# Altium schematic sheet Gateway.SchDoc: Gateway
size A3; Author: Lucas Liaño; Revision: 1; SheetNumber: 2; SheetTotal: 8
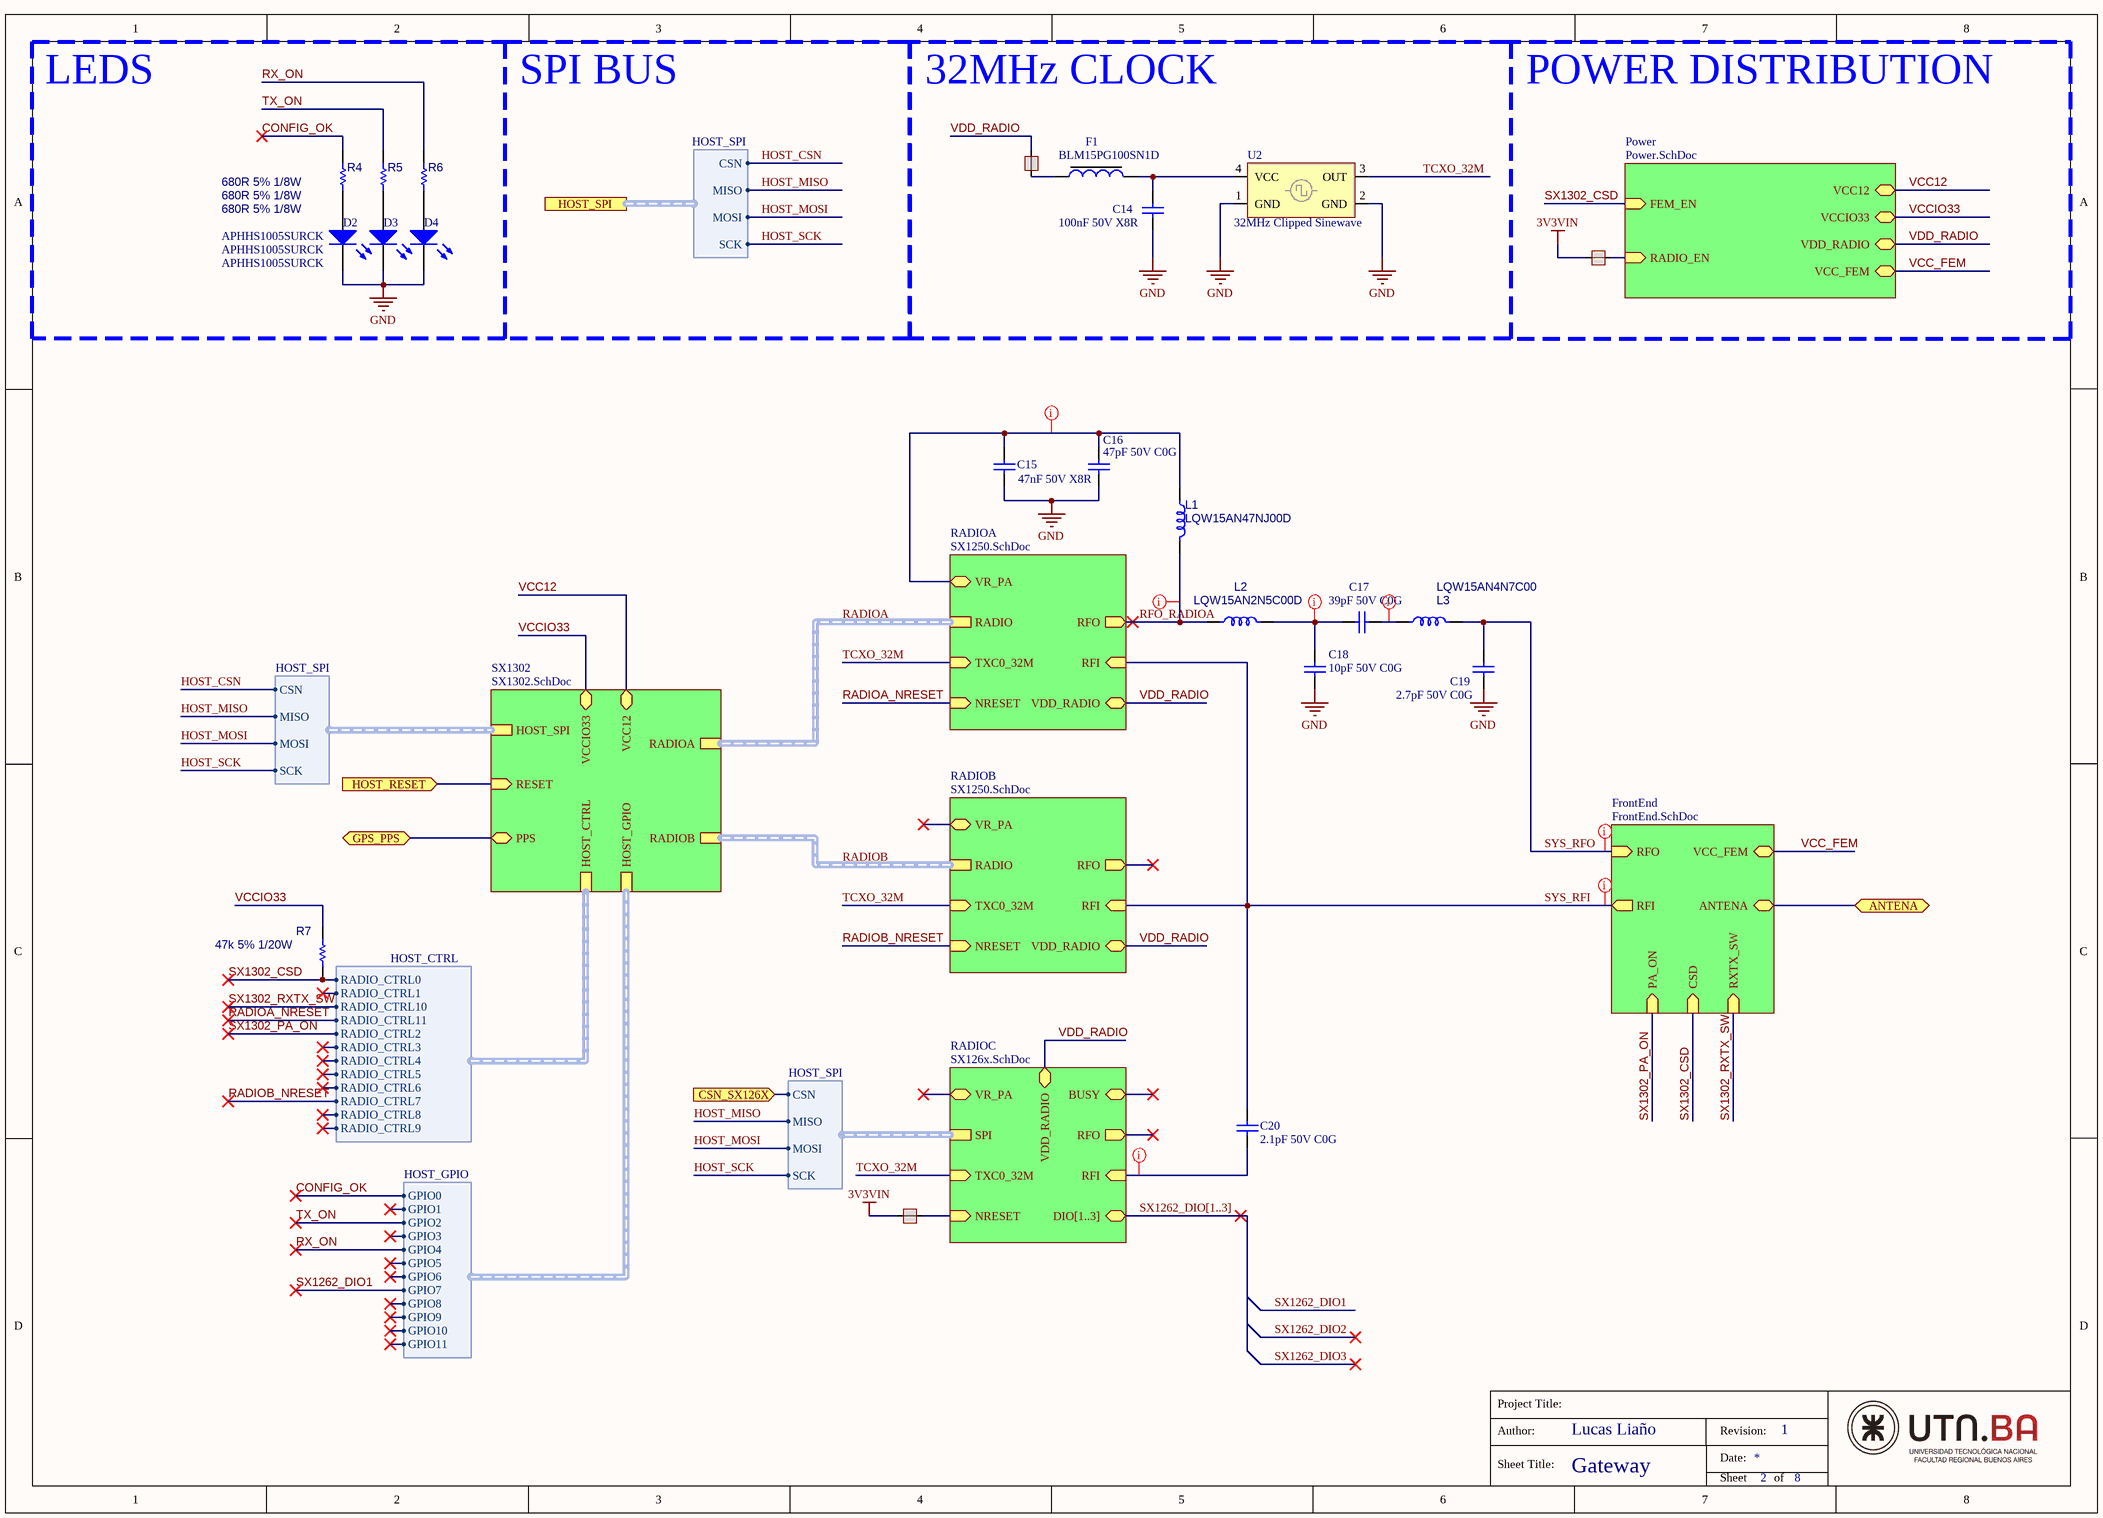
[diagram p0: Gateway.SchDoc]

## Parts
C14  100nF 50V X8R  [C_0603]
C15  47nF 50V X8R  [C_0603]
C16  47pF 50V C0G  [C_0603]
C17  39pF 50V C0G  [C_0603]
C18  10pF 50V C0G  [C_0603]
C19  2.7pF 50V C0G  [C_0603]
C20  2.1pF 50V C0G  [C_0603]
D2  APHHS1005SURCK  [D_0402]
D3  APHHS1005SURCK  [D_0402]
D4  APHHS1005SURCK  [D_0402]
F1  BLM15PG100SN1D  [L_0402]
L1  LQW15AN47NJ00D  [L_0402]
L2  LQW15AN2N5C00D  [L_0402]
L3  LQW15AN4N7C00  [L_0402]
NT1  NT  [NTIE12]  (value not drawn)  (net tie, no BOM)
NT13  NT  [NTIE12]  (value not drawn)  (net tie, no BOM)
NT15  NT  [NTIE12]  (value not drawn)  (net tie, no BOM)
R4  680R 5% 1/8W  [0603[1608]]
R5  680R 5% 1/8W  [0603[1608]]
R6  680R 5% 1/8W  [0603[1608]]
R7  47k 5% 1/20W  [0603[1608]]
U2  32MHz Clipped Sinewave  [TCXO 2.0x1.6mm]

## Blocks framed on the sheet
LEDS: D2-D4 R4-R6

## Sub-sheets
FrontEnd = FrontEnd.SchDoc: ANTENA (bidir), RFO (in), RFI (out), PA_ON (in), CSD (in), RXTX_SW (in), VCC_FEM (bidir)
Power = Power.SchDoc: FEM_EN (in), RADIO_EN (in), VCC12 (bidir), VCCIO33 (bidir), VDD_RADIO (bidir), VCC_FEM (bidir)
RADIOA = SX1250.SchDoc: RFI (in), VR_PA (bidir), RADIO (harness RADIO), NRESET (in), RFO (out), TXC0_32M (in), VDD_RADIO (bidir)
RADIOB = SX1250.SchDoc: VR_PA (bidir), RFO (out), RADIO (harness RADIO), NRESET (in), RFI (in), TXC0_32M (in), VDD_RADIO (bidir)
RADIOC = SX126x.SchDoc: RFI (in), DIO[1..3] (bidir), RFO (out), NRESET (in), SPI (harness HOST_SPI), VR_PA (bidir), TXC0_32M (in), BUSY (bidir), VDD_RADIO (bidir)
SX1302 = SX1302.SchDoc: RADIOB (harness RADIO), HOST_GPIO (harness HOST_GPIO), PPS (bidir), RESET (in), RADIOA (harness RADIO), HOST_CTRL (harness HOST_CTRL), HOST_SPI (harness HOST_SPI), VCCIO33 (bidir), VCC12 (bidir)

## Ports
ANTENA (bidir), CSN_SX126X (in), GPS_PPS (bidir), HOST_RESET (in), HOST_SPI (harness HOST_SPI)

## Harnesses
HOST_CTRL: RADIO_CTRL0, RADIO_CTRL1, RADIO_CTRL10, RADIO_CTRL11, RADIO_CTRL2, RADIO_CTRL3, RADIO_CTRL4, RADIO_CTRL5, RADIO_CTRL6, RADIO_CTRL7, RADIO_CTRL8, RADIO_CTRL9
HOST_GPIO: GPIO1, GPIO2, GPIO3, GPIO4, GPIO5, GPIO6, GPIO7, GPIO8, GPIO9, GPIO10, GPIO11, GPIO0
HOST_SPI: CSN, MISO, MOSI, SCK

## Nets
3V3VIN: NT1.1 NT15.1
GND: C14.2 C15.2 C16.2 C18.1 C19.2 D2.2(K) D3.2(K) D4.2(K) U2.1(GND) U2.2(GND)
ANTENA: port ANTENA, sheet FrontEnd/ANTENA
CONFIG_OK: R4.2 ; sheet SX1302/HOST_GPIO.GPIO0
CSN_SX126X: port CSN_SX126X, sheet RADIOC/SPI.CSN
GPS_PPS: port GPS_PPS, sheet SX1302/PPS
HOST_CSN: port HOST_SPI.CSN, sheet SX1302/HOST_SPI.CSN
HOST_MISO: port HOST_SPI.MISO, sheet SX1302/HOST_SPI.MISO, sheet RADIOC/SPI.MISO
HOST_MOSI: port HOST_SPI.MOSI, sheet SX1302/HOST_SPI.MOSI, sheet RADIOC/SPI.MOSI
HOST_RESET: port HOST_RESET, sheet SX1302/RESET
HOST_SCK: port HOST_SPI.SCK, sheet SX1302/HOST_SPI.SCK, sheet RADIOC/SPI.SCK
RADIOA_NRESET: sheet RADIOA/NRESET, sheet SX1302/HOST_CTRL.RADIO_CTRL11
RADIOB_NRESET: sheet RADIOB/NRESET, sheet SX1302/HOST_CTRL.RADIO_CTRL7
RFO_RADIOA: L1.2 L2.1 ; sheet RADIOA/RFO
RX_ON: R6.2 ; sheet SX1302/HOST_GPIO.GPIO4
SX1262_DIO1: sheet SX1302/HOST_GPIO.GPIO7
SX1302_CSD: R7.1 ; sheet FrontEnd/CSD, sheet Power/FEM_EN, sheet SX1302/HOST_CTRL.RADIO_CTRL0
SX1302_PA_ON: sheet FrontEnd/PA_ON, sheet SX1302/HOST_CTRL.RADIO_CTRL2
SX1302_RXTX_SW: sheet FrontEnd/RXTX_SW, sheet SX1302/HOST_CTRL.RADIO_CTRL10
SYS_RFI: C20.2 ; sheet RADIOA/RFI, sheet RADIOB/RFI, sheet FrontEnd/RFI
SYS_RFO: C19.1 L3.2 ; sheet FrontEnd/RFO
TCXO_32M: U2.3(OUT) ; sheet RADIOA/TXC0_32M, sheet RADIOB/TXC0_32M, sheet RADIOC/TXC0_32M
TX_ON: R5.2 ; sheet SX1302/HOST_GPIO.GPIO2
VCC12: sheet SX1302/VCC12, sheet Power/VCC12
VCC_FEM: sheet FrontEnd/VCC_FEM, sheet Power/VCC_FEM
VCCIO33: R7.2 ; sheet SX1302/VCCIO33, sheet Power/VCCIO33
VDD_RADIO: NT13.2 ; sheet RADIOA/VDD_RADIO, sheet RADIOB/VDD_RADIO, sheet RADIOC/VDD_RADIO, sheet Power/VDD_RADIO
NetC14_1: C14.1 F1.2 U2.4(VCC)
NetC15_1: C15.1 C16.1 L1.1 ; sheet RADIOA/VR_PA
NetC17_1: C17.1 C18.2 L2.2
NetC17_2: C17.2 L3.1
NetC20_1: C20.1 ; sheet RADIOC/RFI
NetD2_1: D2.1(A) R4.1
NetD3_1: D3.1(A) R5.1
NetD4_1: D4.1(A) R6.1
NetF1_1: F1.1 NT13.1
NetNT1_2: NT1.2 ; sheet RADIOC/NRESET
NetNT15_2: NT15.2 ; sheet Power/RADIO_EN

## Buses and harness runs
bus SX1262_DIO[1..3] = sheet RADIOC/DIO[1..3]
harness RADIOA = sheet RADIOA/RADIO = sheet SX1302/RADIOA
harness RADIOB = sheet RADIOB/RADIO = sheet SX1302/RADIOB

## Layout directives
net class RF: NetC15_1, NetC17_1, NetC17_2, NetC20_1, RFO_RADIOA, SYS_RFI, SYS_RFO

## Notes on the sheet
- SPI BUS
- 32MHz CLOCK
- POWER DISTRIBUTION
- Project Title:
- Author:
- Sheet Title:
- Date:
- Revision:
- Sheet
- of

## Library data of the parts
C14 = Cap: Capacitor; MPN: GCM188R91H102KA37D; Manufacturer: Murata Electronics; Package: 0603; Price (USD): 0.2; ComponentLink2Description: SupplierLink; ComponentLink1Description: Datasheet; ComponentLink2URL: https://www.digikey.com/es/products/detail/murata-electronics/GCM188R91H102KA37D/6605989; ComponentLink1URL: https://search.murata.co.jp/Ceramy/image/img/A01X/G101/ENG/GCM188R91H102KA37-01.pdf; Value: 100nF 50V X8R; Supplier: Digikey
C15 = Cap: Capacitor; MPN: GCM188R91H472KA37D; Manufacturer: Murata Electronics; Package: 0603; Price (USD): 0.2; ComponentLink2Description: SupplierLink; ComponentLink1Description: Datasheet; ComponentLink2URL: https://www.digikey.com/es/products/detail/murata-electronics/GCM188R91H472KA37D/11618640; ComponentLink1URL: https://search.murata.co.jp/Ceramy/image/img/A01X/G101/ENG/GCM188R91H472KA37-01.pdf; Value: 47nF 50V X8R; Supplier: Digikey
C16 = Cap: Capacitor; MPN: 0603J0500470GAT; Manufacturer: Knowless Syfer; Package: 0603; Price (USD): 0.25; ComponentLink2Description: SupplierLink; ComponentLink1Description: Datasheet; ComponentLink2URL: https://www.digikey.com/es/products/detail/knowles-syfer/0603J0500470GAT/6285001; ComponentLink1URL: https://www.knowlescapacitors.com/getmedia/44a5a400-a1aa-40c4-ac69-22b5f3d40f81/AEC-Q200-Automotive-Grade-Capacitors-Catalog; Value: 47pF 50V C0G; Supplier: Digikey
C17 = Cap: Capacitor; MPN: 06035A390FAT2A; Manufacturer: Kyocera AVX; Package: 0603; Price (USD): 0.45; ComponentLink2Description: SupplierLink; ComponentLink1Description: Datasheet; ComponentLink2URL: https://www.digikey.com/es/products/detail/kyocera-avx/06035A390FAT2A/1599819; ComponentLink1URL: https://datasheets.kyocera-avx.com/C0GNP0-Dielectric.pdf; Value: 39pF 50V C0G; Supplier: Digikey
C18 = Cap: Capacitor; MPN: GRM0335C1H100FA01D; Manufacturer: Murata Electronics; Package: 0603; Price (USD): 0.1; ComponentLink2Description: SupplierLink; ComponentLink1Description: Datasheet; ComponentLink2URL: https://www.digikey.com/es/products/detail/murata-electronics/GRM0335C1H100FA01D/4358087; ComponentLink1URL: https://search.murata.co.jp/Ceramy/image/img/A01X/G101/ENG/GRM0335C1H100FA01-01.pdf; Value: 10pF 50V C0G; Supplier: Digikey
C19 = Cap: Capacitor; MPN: GRM0335C1H2R7WA01D; Manufacturer: Murata Electronics; Package: 0603; Price (USD): 0.1; ComponentLink2Description: SupplierLink; ComponentLink1Description: Datasheet; ComponentLink2URL: https://www.digikey.com/es/products/detail/murata-electronics/GRM0335C1H2R7WA01D/11618507?s=N4IgTCBcDaIOICUCyAGAzGgrAYQIwAkwEB2AdQEEVcAREAXQF8g; ComponentLink1URL: https://search.murata.co.jp/Ceramy/image/img/A01X/G101/ENG/GRM0335C1H2R7WA01-01.pdf; Value: 2.7pF 50V C0G; Supplier: Digikey
C20 = Cap: Capacitor; MPN: ML03512R1BAT2A; Manufacturer: Kyocera AVX; Package: 0603; Price (USD): 0.52; ComponentLink2Description: SupplierLink; ComponentLink1Description: Datasheet; ComponentLink2URL: https://www.digikey.com/es/products/detail/kyocera-avx/ML03512R1BAT2A/2694197; ComponentLink1URL: https://datasheets.kyocera-avx.com/ML03.pdf; Value: 2.1pF 50V C0G; Supplier: Digikey
D2-D4 = LED: Manufacturer: kingbright; Value: LED RED CLEAR CHIP SMD; ComponentLink1Description: Datasheet; ComponentLink2Description: SupplierLink; MPN: APHHS1005SURCK; Package: 0402  [1005]; Price (USD): 0.5; Supplier: Digikey
  D2: ComponentLink1URL: https://www.kingbrightusa.com/images/catalog/SPEC/APHHS1005SURCK.pdf; ComponentLink2URL: https://www.digikey.com/en/products/detail/kingbright/APHHS1005SURCK/1747502
F1 = Ferrite beads: Ferrite bead 10 ohm 1A; Manufacturer: Murata Electronics; ComponentLink1Description: Datasheet; ComponentLink2Description: SupplierLink; MPN: BLM15PG100SN1D; Package: 0402; Price (USD): 0.1; Supplier: Digikey; Value: Ferrite bead 10 ohm 1A
L1-L3 = IND: Inductor; Manufacturer: *; Package: *; Price (USD): *; Value: *; ComponentLink1Description: Datasheet; ComponentLink1URL: *; ComponentLink2Description: SupplierLink; ComponentLink2URL: *
  L1: MPN: LQW15AN47NJ00D
  L2: MPN: LQW15AN2N5C00D
  L3: MPN: LQW15AN4N7C00
NT1 NT13 NT15 = NTIE: NET_TIE; ComponentLink1Description: Datasheet; ComponentLink2Description: SupplierLink
R4-R6 = Res: Resistor; Manufacturer: Panasonic Electronic Components; MPN: ERJ-H3GJ681V; Package: 0603; Price (USD): 0.17; Value: 680R 5% 1/8W; ComponentLink1Description: Datasheet; ComponentLink2Description: SupplierLink; Supplier: Digikey
  R4: ComponentLink1URL: https://www.digikey.com/es/products/detail/panasonic-electronic-components/ERJ-H3GJ681V/13877999; ComponentLink2URL: https://www.digikey.com/es/products/detail/panasonic-electronic-components/ERJ-H3GJ681V/13877999
  R5 R6: ComponentLink1URL: *; ComponentLink2URL: *
R7 = Res: Resistor; Manufacturer: Vishay; MPN: M55342K11B47K0MT1V; Package: 0603; Price (USD): 0.2; Value: 47k 5% 1/20W; ComponentLink1Description: Datasheet; ComponentLink1URL: https://www.digikey.com/es/products/detail/vishay-dale-thin-film/M55342K11B47K0MT1V/3585297?s=N4IgjCBcoExaBjKAzAhgGwM4FMA0IB7KAbRAHYBWGAFhAF18AHAFyhAGVmAnASwDsA5iAC%2B%2BAMzwQSSGix5CJEDAoAGCQxAs2nXoJH4wANknTZOfEUikxATjAUAHPSatIHbvyGilKhxRMoGOYKViDUZAAEANYA8gAWALaYzpquIACqfDzMMcgAstiomACuXNgi3nChZZg8mMwEXMl0wkA; ComponentLink2Description: SupplierLink; ComponentLink2URL: https://www.digikey.com/es/products/detail/vishay-dale-thin-film/M55342K11B47K0MT1V/3585297?s=N4IgjCBcoExaBjKAzAhgGwM4FMA0IB7KAbRAHYBWGAFhAF18AHAFyhAGVmAnASwDsA5iAC%2B%2BAMzwQSSGix5CJEDAoAGCQxAs2nXoJH4wANknTZOfEUikxATjAUAHPSatIHbvyGilKhxRMoGOYKViDUZAAEANYA8gAWALaYzpquIACqfDzMMcgAstiomACuXNgi3nChZZg8mMwEXMl0wkA; Supplier: Digikey
U2 = TCXO: 32MHz TCXO - Clipped Sinewave Output; Manufacturer: NDK America; MPN: NT2016SA 32MHz END4263A; ComponentLink1Description: Datasheet; ComponentLink1URL: https://media.digikey.com/pdf/Data%20Sheets/NDK%20PDFs/NT2016SA-32M-END4263A.pdf; ComponentLink2Description: SupplierLink; ComponentLink2URL: https://www.digikey.com/en/products/detail/ndk-america-inc/NT2016SA-32M-END4263A/8275433; Package: 4-SMD; Price (USD): 1; Supplier: Digikey; Value: 32MHz TCXO - Clipped Sinewave Output